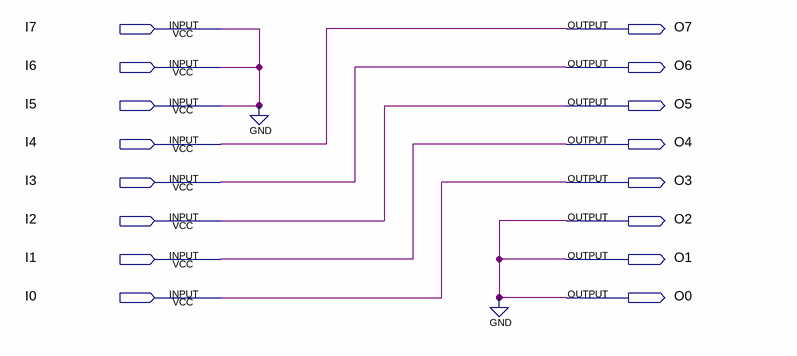
[diagram p0: schematic sheet]
// Quartus schematic SL3.bdf as structural Verilog: 0 symbols, 16 pins
module SL3 (
  input  I7,
  input  I6,
  input  I5,
  input  I4,
  input  I3,
  input  I2,
  input  I1,
  input  I0,
  output O7,
  output O6,
  output O5,
  output O4,
  output O3,
  output O2,
  output O1,
  output O0
);


  assign I6 = I5;
  assign I7 = I5;
  assign O0 = 1'b0;
  assign O1 = 1'b0;
  assign O2 = 1'b0;
  assign O3 = I0;
  assign O4 = I1;
  assign O5 = I2;
  assign O6 = I3;
  assign O7 = I4;
  // also tied to GND on the sheet: I5
endmodule
